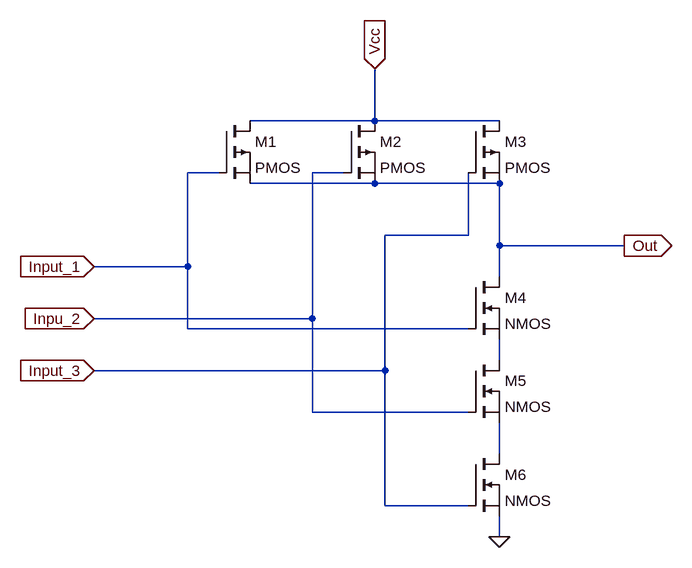
[diagram p0: schematic Draft4.asc]
Draft4.asc, the LTspice schematic file:
Version 4
SHEET 1 920 784
WIRE 448 128 448 48
WIRE 448 128 256 128
WIRE 640 128 448 128
WIRE 208 208 160 208
WIRE 400 208 352 208
WIRE 448 224 256 224
WIRE 640 224 448 224
WIRE 592 304 592 208
WIRE 592 304 464 304
WIRE 640 320 640 224
WIRE 832 320 640 320
WIRE 160 352 160 208
WIRE 160 352 16 352
WIRE 640 368 640 320
WIRE 352 432 352 208
WIRE 352 432 16 432
WIRE 160 448 160 352
WIRE 592 448 160 448
WIRE 640 496 640 464
WIRE 464 512 464 304
WIRE 464 512 16 512
WIRE 352 576 352 432
WIRE 592 576 352 576
WIRE 640 640 640 592
WIRE 464 720 464 512
WIRE 592 720 464 720
WIRE 640 768 640 736
FLAG 640 768 0
FLAG 832 320 Out
IOPIN 832 320 Out
FLAG 16 352 Input_1
IOPIN 16 352 In
FLAG 16 432 Inpu_2
IOPIN 16 432 In
FLAG 16 512 Input_3
IOPIN 16 512 In
FLAG 448 48 Vcc
IOPIN 448 48 In
SYMBOL pmos 208 128 R0
SYMATTR InstName M1
SYMBOL pmos 400 128 R0
SYMATTR InstName M2
SYMBOL pmos 592 128 R0
SYMATTR InstName M3
SYMBOL nmos 592 368 R0
SYMATTR InstName M4
SYMBOL nmos 592 496 R0
SYMATTR InstName M5
SYMBOL nmos 592 640 R0
SYMATTR InstName M6

The netlist it stands for:
* Draft4.asc
M1 Vcc Input_1 Out Out PMOS
M2 Vcc Inpu_2 Out Out PMOS
M3 Vcc Input_3 Out Out PMOS
M4 Out Input_1 N001 N001 NMOS
M5 N001 Inpu_2 N002 N002 NMOS
M6 N002 Input_3 0 0 NMOS
.model NMOS NMOS
.model PMOS PMOS
.lib standard.mos
.backanno
.end